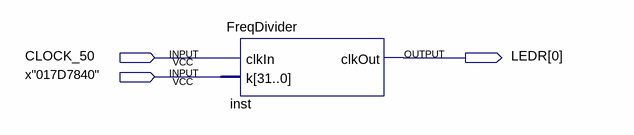
[diagram p0: schematic sheet]
// Quartus schematic FreqDivider_Demo.bdf as structural Verilog: 1 symbols, 3 pins
module FreqDivider_Demo (
  input  CLOCK_50,
  input  \x"017D7840" ,
  output [0:0] LEDR
);

  FreqDivider inst (.clkIn(CLOCK_50), .k({32{\x"017D7840" }}), .clkOut(LEDR[0]));
endmodule
